# Altium schematic sheet main.SchDoc
size A4; SheetNumber: 1; SheetTotal: 2
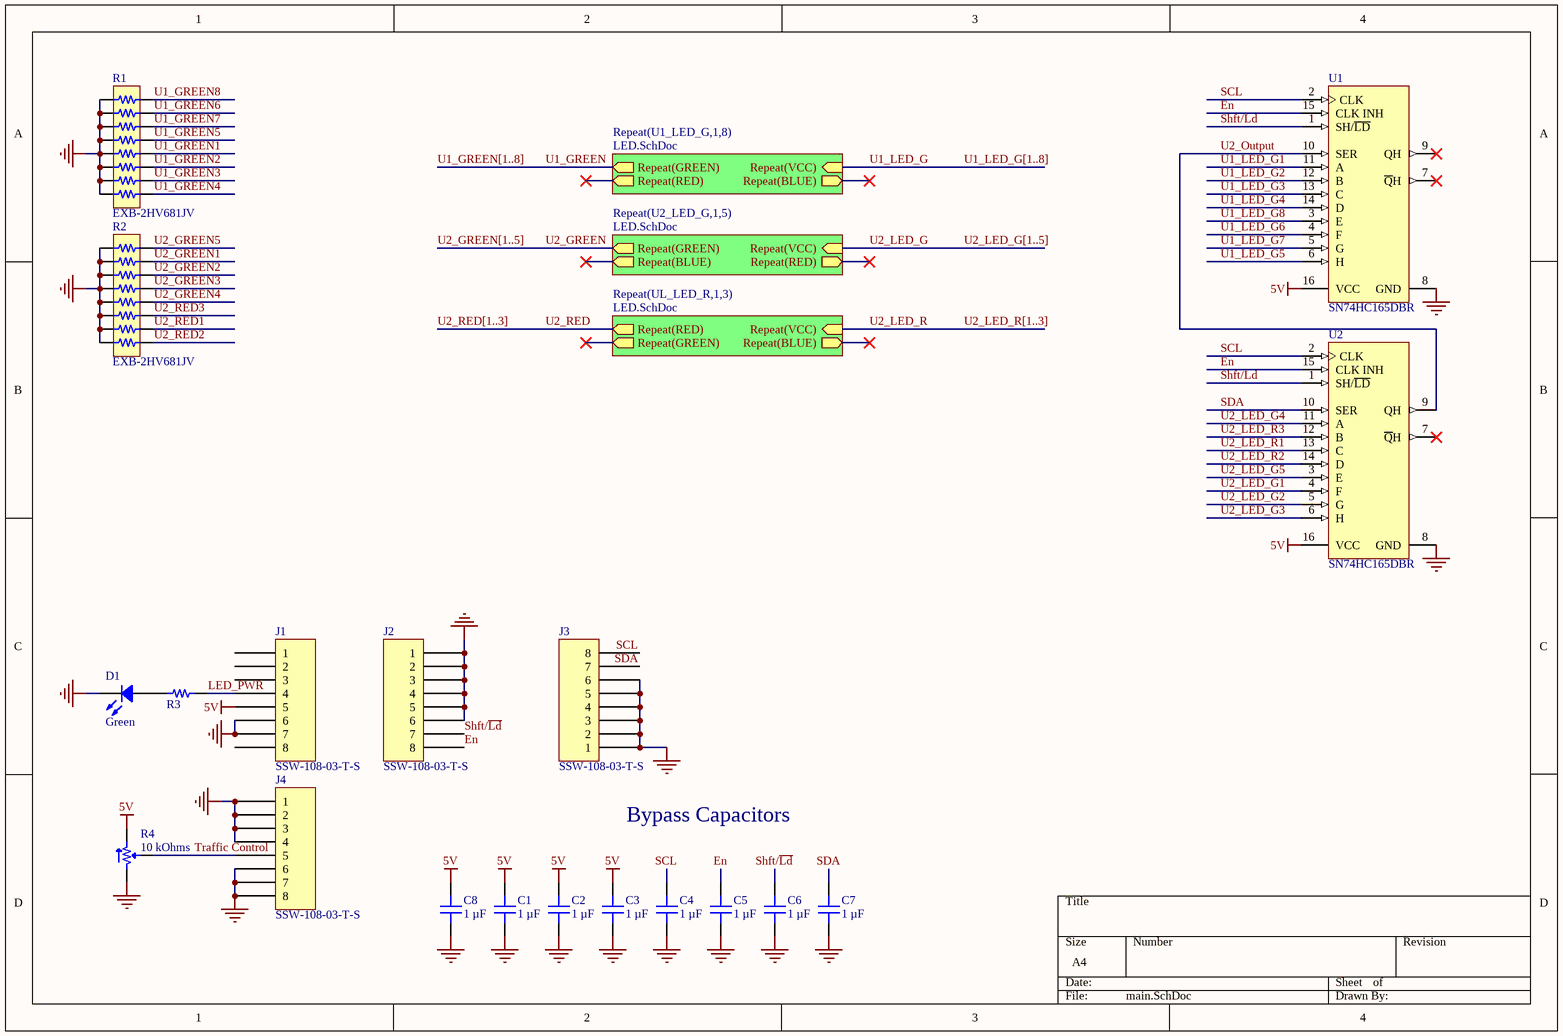
[diagram p0: main.SchDoc]

## Parts
C1  1 µF  [CAP 0805_2012]
C2  1 µF  [CAP 0805_2012]
C3  1 µF  [CAP 0805_2012]
C4  1 µF  [CAP 0805_2012]
C5  1 µF  [CAP 0805_2012]
C6  1 µF  [CAP 0805_2012]
C7  1 µF  [CAP 0805_2012]
C8  1 µF  [CAP 0805_2012]
D1  Green  [LED 0805_2012 GREEN]
J1  SSW-108-03-T-S  [SAMTEC SSW-108-03-T-S]
J2  SSW-108-03-T-S  [SAMTEC SSW-108-03-T-S]
J3  SSW-108-03-T-S  [SAMTEC SSW-108-03-T-S]
J4  SSW-108-03-T-S  [SAMTEC SSW-108-03-T-S]
R1  EXB-2HV681JV  [RESNET 1506-16 CONVEX]
R2  EXB-2HV681JV  [RESNET 1506-16 CONVEX]
R3  0 Ohms  [RES 0805_2012]  (value not drawn)
R4  10 kOhms  [BOURNS TRIMPOT 3362P-1]
U1  SN74HC165DBR  [DB0016A_N]
U2  SN74HC165DBR  [DB0016A_N]

## Sub-sheets
Repeat(U1_LED_G,1,8) = LED.SchDoc: Repeat(VCC) (in), Repeat(GREEN) (out), Repeat(RED) (out), Repeat(BLUE) (out)
Repeat(U2_LED_G,1,5) = LED.SchDoc: Repeat(VCC) (in), Repeat(GREEN) (out), Repeat(BLUE) (out), Repeat(RED) (out)
Repeat(UL_LED_R,1,3) = LED.SchDoc: Repeat(VCC) (in), Repeat(RED) (out), Repeat(GREEN) (out), Repeat(BLUE) (out)

## Nets
5V: C1.2 C2.2 C3.2 C8.2 J1.5 R4.3 U1.16(VCC) U2.16(VCC)
GND: C1.1 C2.1 C3.1 C4.1 C5.1 C6.1 C7.1 C8.1 D1.2 J1.6 J1.7 J2.1 J2.2 J2.3 J2.4 J2.5 J2.6 J3.1 J3.2 J3.3 J3.4 J3.5 J3.6 J4.1 J4.2 J4.3 J4.4 J4.6 J4.7 J4.8 R1.1 R1.2 R1.3 R1.4 R1.5 R1.6 R1.7 R1.8 R2.1 R2.2 R2.3 R2.4 R2.5 R2.6 R2.7 R2.8 R4.1 U1.8(GND) U2.8(GND)
En: C5.2 J2.8 U1.15(CLK_INH) U2.15(CLK_INH)
LED_PWR: J1.4 R3.1
SCL: C4.2 J3.8 U1.2(CLK) U2.2(CLK)
SDA: C7.2 J3.7 U2.10(SER)
Shft/~{Ld}: C6.2 J2.7 U1.1(SH/~{LD}) U2.1(SH/~{LD})
Traffic Control: J4.5 R4.2
U1_GREEN: sheet Repeat(U1_LED_G,1,8)/Repeat(GREEN)
U1_GREEN1: R1.12
U1_GREEN2: R1.11
U1_GREEN3: R1.10
U1_GREEN4: R1.9
U1_GREEN5: R1.13
U1_GREEN6: R1.15
U1_GREEN7: R1.14
U1_GREEN8: R1.16
U1_LED_G: sheet Repeat(U1_LED_G,1,8)/Repeat(VCC)
U1_LED_G1: U1.11(A)
U1_LED_G2: U1.12(B)
U1_LED_G3: U1.13(C)
U1_LED_G4: U1.14(D)
U1_LED_G5: U1.6(H)
U1_LED_G6: U1.4(F)
U1_LED_G7: U1.5(G)
U1_LED_G8: U1.3(E)
U2_GREEN: sheet Repeat(U2_LED_G,1,5)/Repeat(GREEN)
U2_GREEN1: R2.15
U2_GREEN2: R2.14
U2_GREEN3: R2.13
U2_GREEN4: R2.12
U2_GREEN5: R2.16
U2_LED_G: sheet Repeat(U2_LED_G,1,5)/Repeat(VCC)
U2_LED_G1: U2.4(F)
U2_LED_G2: U2.5(G)
U2_LED_G3: U2.6(H)
U2_LED_G4: U2.11(A)
U2_LED_G5: U2.3(E)
U2_LED_R: sheet Repeat(UL_LED_R,1,3)/Repeat(VCC)
U2_LED_R1: U2.13(C)
U2_LED_R2: U2.14(D)
U2_LED_R3: U2.12(B)
U2_Output: U1.10(SER) U2.9(QH)
U2_RED: sheet Repeat(UL_LED_R,1,3)/Repeat(RED)
U2_RED1: R2.10
U2_RED2: R2.9
U2_RED3: R2.11
NetD1_1: D1.1 R3.2

Not connected (* = marked no-connect by the designer): J1 1 2 3 8; U1 7(~{Q}H)* 9(QH)*; U2 7(~{Q}H)*

## Buses and harness runs
bus U1_GREEN[1..8]
bus U1_LED_G[1..8]
bus U2_GREEN[1..5]
bus U2_LED_G[1..5]
bus U2_LED_R[1..3]
bus U2_RED[1..3]

## Notes on the sheet
- Bypass Capacitors

## Library data of the parts
C1-C8 = 885012207022: CAP CER 1UF 10V X7R 0805; manufacturer: Würth Elektronik; Tolerance: ±10%; Part Number: 885012207022; Value: 1 µF; Applications: General Purpose; Capacitance: 1 µF; componentlink1description: Datasheet; componentlink1url: https://katalog.we-online.de/pbs/datasheet/885012207022.pdf; componentlink2description: DigiKey Link; componentlink2url: https://www.digikey.com/en/products/detail/würth-elektronik/885012207022/5453509; Device Package: 0805 (2012 Metric); lastupdated: 2022-09-19 1:04:10 PM; Lifecycle Status: Active; Minimum Order: 1; Mounting Type: Surface Mount, MLCC; Operating Temperature: -55°C ~ 125°C; Package / Case: 0805 (2012 Metric); packaging: TapeAndReel; partid: 9332; Part Status: Active; price: 0.06; series: WCAP-CSGP; Size / Dimension: 0.079" L x 0.049" W (2.00mm x 1.25mm); Supplier 1: DigiKey; Supplier Part Number 1: 732-7654-1-ND; Temperature Coefficient: X7R; Thickness (Max): 0.053" (1.35mm); Voltage - Rated: 10V
D1 = XZVG54W-1: LED GREEN CLEAR CHIP SMD; Manufacturer: SunLED; Configuration: Standard; Current - Test: 20mA; Lens Color: Colorless; Lens Size: 1.20mm x 1.25mm; Lens Style: Rectangle with Flat Top; Millicandela Rating: 49mcd; Viewing Angle: 120°; Voltage - Forward (Vf) (Typ): 2.1V; Wavelength - Dominant: 570nm; Wavelength - Peak: 574nm; Part Number: XZVG54W-1; Color: Green; ComponentLink1Description: Datasheet; ComponentLink1URL: https://www.sunledusa.com/products/spec/XZVG54W-1.pdf; ComponentLink2Description: DigiKey Link; ComponentLink2URL: https://www.digikey.com/en/products/detail/sunled/XZVG54W-1/4745972; Device Package: 0805 (2012 Metric); Height (Max): 0.85mm; LastUpdated: 2022-09-14 8:37:01 AM; Lens Transparency: Clear; Lifecycle Status: Active; Minimum Order: 1; Mounting Type: Surface Mount; Package / Case: 0805 (2012 Metric); Packaging: TapeAndReel; PartId: 267; Part Status: Active; Price: 0.05; Series: -; Size / Dimension: 2.00mm L x 1.25mm W; Supplier 1: DigiKey; Supplier Part Number 1: 1497-1216-1-ND; Supplier Device Package: Chip LED; Value: Green
J1-J4 = SSW-108-03-T-S: CONN RCPT 8POS 0.1 TIN PCB; Manufacturer: Samtec Inc.; Connector Type: Receptacle; Contact Length - Post: 0.394" (10.00mm); Current Rating (Amps): 5.7A per Contact; Material Flammability Rating: UL94 V-0; Number of Positions: 8; Number of Positions Loaded: All; Pitch - Mating: 0.100" (2.54mm); Style: Board to Board or Cable; Part Number: SSW-108-03-T-S; ComponentLink1Description: Datasheet; ComponentLink1URL: http://suddendocs.samtec.com/catalog_english/ssw_th.pdf; ComponentLink2Description: DigiKey Link; ComponentLink2URL: https://www.digikey.com/en/products/detail/samtec-inc/SSW-108-03-T-S/1790200; Contact Finish - Mating: Tin; Contact Finish - Post: Tin; Contact Type: Forked; Fastening Type: Push-Pull; Insulation Color: Black; Insulation Height: 0.335" (8.51mm); LastUpdated: 2022-06-21 3:09:52 PM; Lifecycle Status: Active; Minimum Order: 1; Mounting Type: Through Hole; Number of Rows: 1; Operating Temperature: -55°C ~ 105°C; Packaging: Bulk; Part Status: Active; Price: 0.73; Series: SSW; Supplier 1: DigiKey; Supplier Part Number 1: SAM8866-ND; Termination: Solder
R1 R2 = EXB-2HV681JV: RES ARRAY 8 RES 680 OHM 1506; Manufacturer: Panasonic Electronic Components; Circuit Type: Isolated; Number of Resistors: 8; Power Per Element: 62.5mW; Resistance (Ohms): 680; Temperature Coefficient: ±200ppm/°C; Tolerance: ±5%; Part Number: EXB-2HV681JV; Applications: Automotive AEC-Q200; ComponentLink1Description: Datasheet; ComponentLink1URL: https://industrial.panasonic.com/cdbs/www-data/pdf/AOC0000/AOC0000C14.pdf; ComponentLink2Description: DigiKey Link; ComponentLink2URL: https://www.digikey.com/en/products/detail/panasonic-electronic-components/EXB-2HV681JV/285317; Height - Seated (Max): 0.022" (0.55mm); LastUpdated: 2022-09-14 8:40:22 AM; Lifecycle Status: Active; Minimum Order: 1; Mounting Type: Surface Mount; Number of Pins: 16; Operating Temperature: -55°C ~ 125°C; Package / Case: 1506, Convex, Long Side Terminals; Packaging: TapeAndReel; PartId: 684; Part Status: Active; Price: 0.03; Series: EXB; Size / Dimension: 0.150" L x 0.063" W (3.80mm x 1.60mm); Supplier 1: DigiKey; Supplier Part Number 1: Y1681CT-ND; Supplier Device Package: 1506
R3 = CR0805AJ/-000EAS: RESA-AS 0805 0R JUMPER 125MW; Manufacturer: Bourns Inc.; Power (Watts): 0.125W, 1/8W; Part Number: CR0805AJ/-000EAS; Value: 0 Ohms; ComponentLink1Description: Datasheet; ComponentLink1URL: //media.digikey.com/pdf/Data%20Sheets/Bourns%20PDFs/CRyyyyA-AS_Model_DS.pdf; ComponentLink2Description: DigiKey Link; ComponentLink2URL: https://www.digikey.com/en/products/detail/bourns-inc/CR0805AJ-000EAS/10240129; Composition: Thick Film; Device Package: 0805 (2012 Metric); Features: Anti-Sulfur, Automotive AEC-Q200, Moisture Resistant; Height - Seated (Max): 0.024" (0.60mm); LastUpdated: 2022-09-14 8:22:37 AM; Lifecycle Status: Active; Minimum Order: 1; Number of Terminations: 2; Operating Temperature: -55°C ~ 155°C; Package / Case: 0805 (2012 Metric); Packaging: TapeAndReel; PartId: 49707; Part Status: Active; Price: 0.01; Ratings: AEC-Q200; Resistance: 0 Ohms; Series: CR0805A-AS; Size / Dimension: 0.079" L x 0.049" W (2.00mm x 1.25mm); Supplier 1: DigiKey; Supplier Part Number 1: CR0805AJ/-000EASCT-ND; Supplier Device Package: 0805; Tolerance: Jumper
R4 = 3362P-1-103LF: TRIMMER 10K OHM 0.5W PC PIN TOP; Manufacturer: Bourns Inc.; Adjustment Type: Top Adjustment; Number of Turns: 1; Power (Watts): 0.5W, 1/2W; Resistive Material: Cermet; Temperature Coefficient: ±100ppm/°C; Tolerance: ±10%; Part Number: 3362P-1-103LF; ComponentLink1Description: Datasheet; ComponentLink1URL: https://www.bourns.com/docs/Product-Datasheets/3362.pdf; ComponentLink2Description: DigiKey Link; ComponentLink2URL: https://www.digikey.com/en/products/detail/bourns-inc/3362P-1-103LF/1088412; LastUpdated: 2022-09-14 8:53:23 AM; Lifecycle Status: Active; Minimum Order: 1; Mounting Type: Through Hole; Packaging: Tube; PartId: 136; Part Status: Active; Price: 0.46; Resistance: 10 kOhms; Series: Trimpot® 3362 - Sealed; Size / Dimension: Rectangular - 0.275" x 0.260" Face (6.99mm x 6.60mm); Supplier 1: DigiKey; Supplier Part Number 1: 3362P-103LF-ND; Termination Style: PC Pins; Value: 10 kOhms
U1 U2 = CMP-0780-00071-3: 8-Bit Parallel-Load Shift Registers, DB0016A, LARGE T&R; Manufacturer: Texas Instruments; Bits: 8; Input Type: CMOS; Rating: Catalog; Technology Family: HC; 3-State Output: No; Voltage(Nom)(V): 6; tpd @ Nom Voltage(Max)(ns): 38; ICC @ Nom Voltage(Max)(mA): 0.08; Output Drive (IOL/IOH)(Max)(mA): 5.2/-5.2; VCC(Min)(V): 2; F @ Nom Voltage(Max)(Mhz): 28; Code_JEDEC: MO-150; Operating Temperature Range(C): -40 to 125; DatasheetVersion: SCLS116G; PackageVersion: http://www.ti.com/lit/ml/mpds507/mpds507.pdf; PackageReference: DB0016A; Generic Part Number: SN74HC165; Output Type: CMOS; VCC(Max)(V): 6